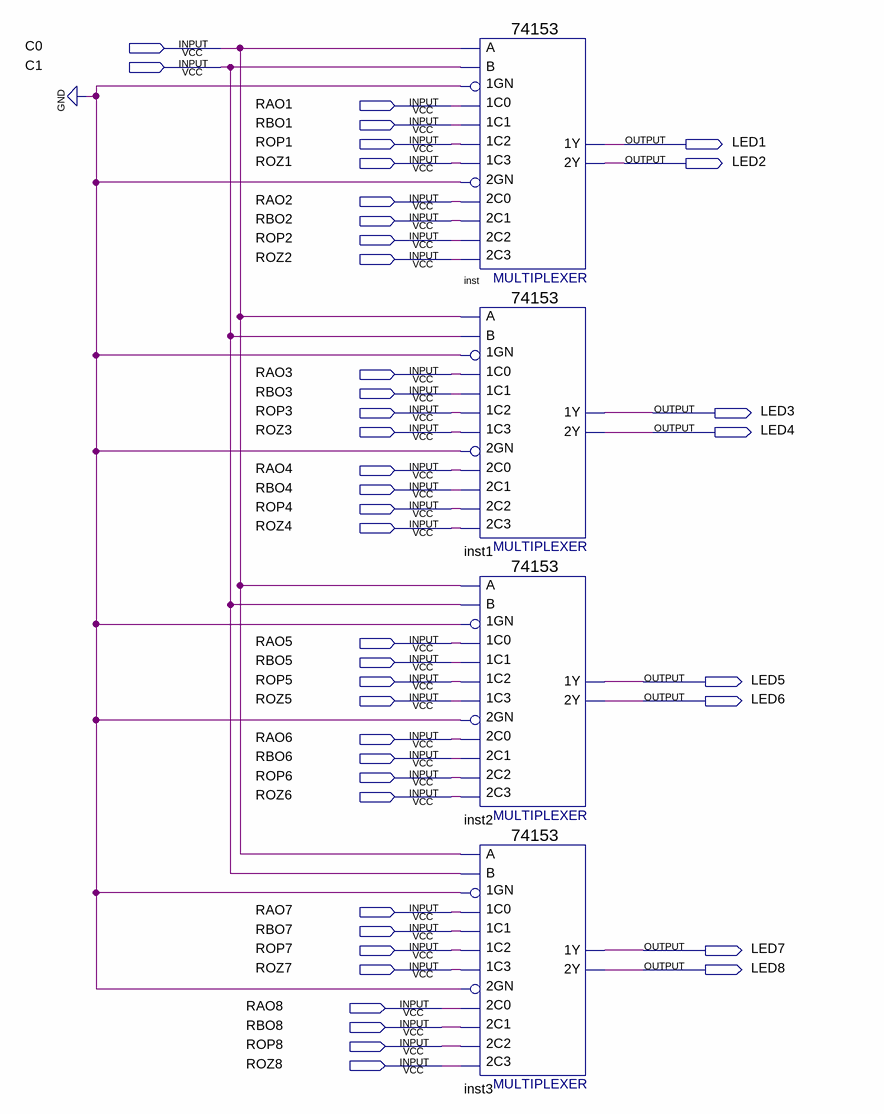
[diagram p0: schematic sheet]
// Quartus schematic Figura4.bdf as structural Verilog: 4 symbols, 42 pins
module Figura4 (
  input  C0,
  input  C1,
  input  RAO1,
  input  RBO1,
  input  ROP1,
  input  ROZ1,
  input  RAO2,
  input  RBO2,
  input  ROP2,
  input  ROZ2,
  input  RAO3,
  input  RBO3,
  input  ROP3,
  input  ROZ3,
  input  RAO4,
  input  RBO4,
  input  ROP4,
  input  ROZ4,
  input  RAO5,
  input  RBO5,
  input  ROP5,
  input  ROZ5,
  input  RAO6,
  input  RBO6,
  input  ROP6,
  input  ROZ6,
  input  RAO7,
  input  RBO7,
  input  ROP7,
  input  ROZ7,
  input  RAO8,
  input  RBO8,
  input  ROP8,
  input  ROZ8,
  output LED1,
  output LED2,
  output LED3,
  output LED4,
  output LED5,
  output LED6,
  output LED7,
  output LED8
);

  \74153  inst (
    .\1C1 (RBO1), .\1GN (1'b0), .\1C0 (RAO1), .\2C0 (RAO2), .\2GN (1'b0), .\2C2 (ROP2), .\1C2 (ROP1),
    .\1C3 (ROZ1), .B(C1), .A(C0), .\2C1 (RBO2), .\2C3 (ROZ2), .\1Y (LED1), .\2Y (LED2));
  \74153  inst1 (
    .\1C1 (RBO3), .\1GN (1'b0), .\1C0 (RAO3), .\2C0 (RAO4), .\2GN (1'b0), .\2C2 (ROP4), .\1C2 (ROP3),
    .\1C3 (ROZ3), .B(C1), .A(C0), .\2C1 (RBO4), .\2C3 (ROZ4), .\1Y (LED3), .\2Y (LED4));
  \74153  inst2 (
    .\1C1 (RBO5), .\1GN (1'b0), .\1C0 (RAO5), .\2C0 (RAO6), .\2GN (1'b0), .\2C2 (ROP6), .\1C2 (ROP5),
    .\1C3 (ROZ5), .B(C1), .A(C0), .\2C1 (RBO6), .\2C3 (ROZ6), .\1Y (LED5), .\2Y (LED6));
  \74153  inst3 (
    .\1C1 (RBO7), .\1GN (1'b0), .\1C0 (RAO7), .\2C0 (RAO8), .\2GN (1'b0), .\2C2 (ROP8), .\1C2 (ROP7),
    .\1C3 (ROZ7), .B(C1), .A(C0), .\2C1 (RBO8), .\2C3 (ROZ8), .\1Y (LED7), .\2Y (LED8));
endmodule
